# EAGLE design ip_extra (EAGLE 6.4)
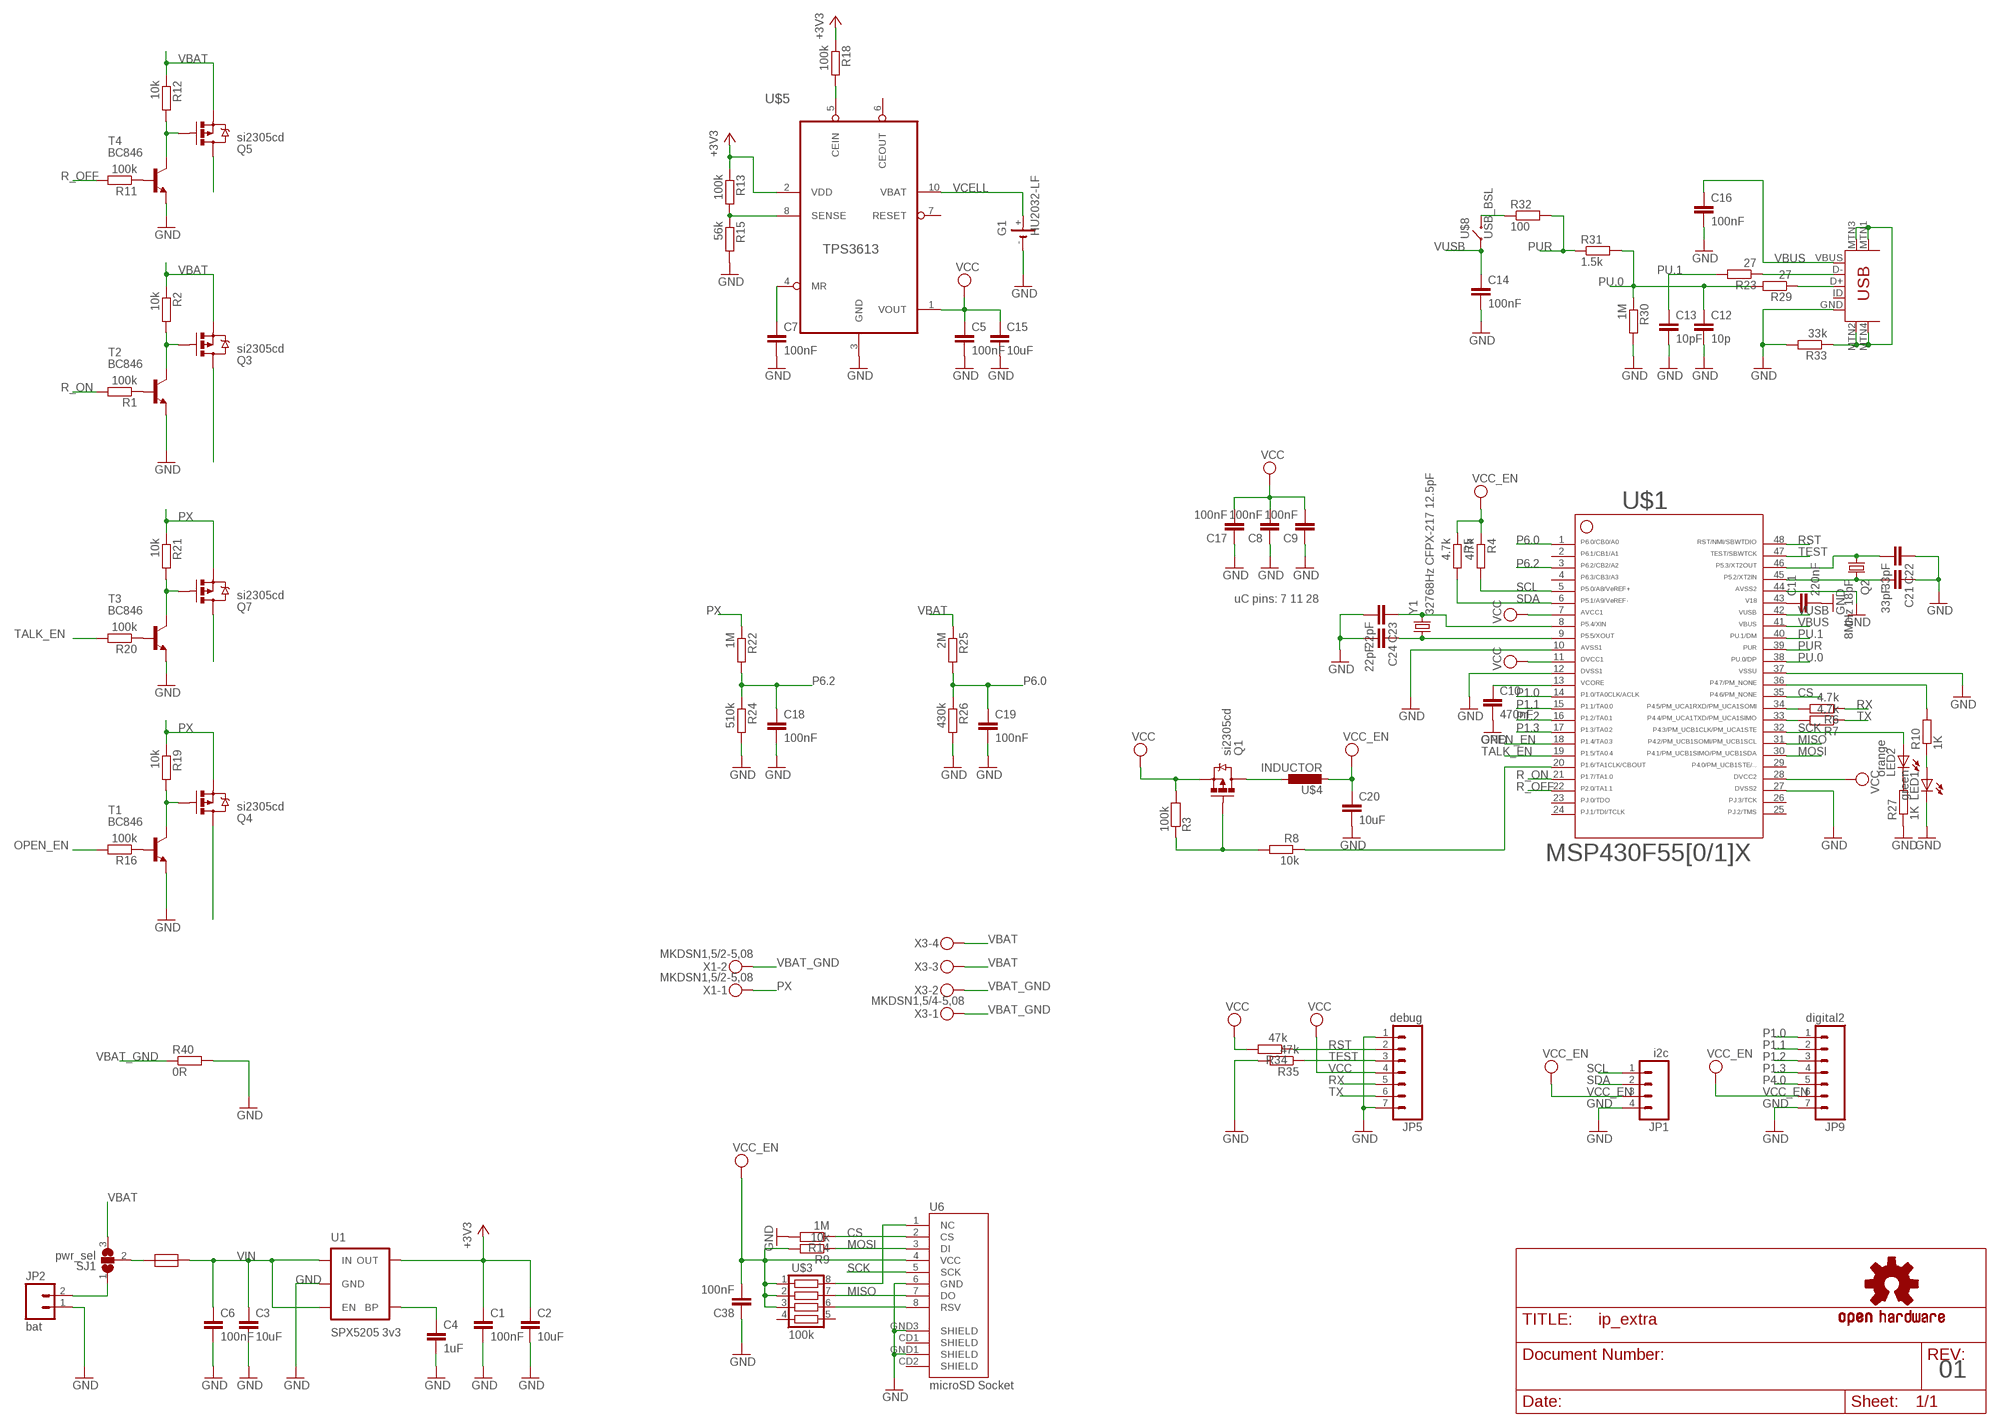
[diagram p0: schematic, sheet 1]

## Parts
C1  100nF  C-EUC0805  [C0805]
C2  10uF  C-EUC1206  [C1206]
C3  10uF  C-EUC1206  [C1206]
C4  1uF  C-EUC0805  [C0805]
C5  100nF  C-EUC0805  [C0805]
C6  100nF  C-EUC0805  [C0805]
C7  100nF  C-EUC0805  [C0805]
C8  100nF  C-EUC0805  [C0805]
C9  100nF  C-EUC0805  [C0805]
C10  470nF  C-EUC0805  [C0805]
C11  220nF  C-EUC0805  [C0805]
C12  10p  C-EUC0805  [C0805]
C13  10pF  C-EUC0805  [C0805]
C14  100nF  C-EUC0805  [C0805]
C15  10uF  C-EUC1206  [C1206]
C16  100nF  C-EUC0805  [C0805]
C17  100nF  C-EUC0805  [C0805]
C18  100nF  C-EUC0805  [C0805]
C19  100nF  C-EUC0805  [C0805]
C20  10uF  C-EUC1206  [C1206]
C21  33pF  C-EUC0805  [C0805]
C22  33pF  C-EUC0805  [C0805]
C23  22pF  C-EUC0805  [C0805]
C24  22pF  C-EUC0805  [C0805]
C38  100nF  C-EUC0805  [C0805]
G1  HU2032-LF  [HU2032-LF]
JP1  i2c  M04PTH  [1X04]
JP2  bat  M02PTH  [1X02]
JP5  debug  M07  [1X07]
JP9  digital2  M07  [1X07]
LED1  green  LEDCHIP-LED0805  [CHIP-LED0805]
LED2  orange  LEDCHIP-LED0805  [CHIP-LED0805]
Q1  si2305cd  MOSFET-PCHANNELSMD_POWER  [SOT23-3_POWER]
Q2  8MHz 18pF  CRYTAL  [CRYSTAL_5X3.2]
Q3  si2305cd  MOSFET-PCHANNELSMD_POWER  [SOT23-3_POWER]
Q4  si2305cd  MOSFET-PCHANNELSMD_POWER  [SOT23-3_POWER]
Q5  si2305cd  MOSFET-PCHANNELSMD_POWER  [SOT23-3_POWER]
Q7  si2305cd  MOSFET-PCHANNELSMD_POWER  [SOT23-3_POWER]
R1  100k  R-EU_R0805W  [R0805W]
R2  10k  R-EU_R0805W  [R0805W]
R3  100k  R-EU_R0805W  [R0805W]
R4  4.7k  R-EU_R0805W  [R0805W]
R5  4.7k  R-EU_R0805W  [R0805W]
R6  4.7k  R-EU_R0805W  [R0805W]
R7  4.7k  R-EU_R0805W  [R0805W]
R8  10k  R-EU_R0805W  [R0805W]
R9  10k  R-EU_R0805W  [R0805W]
R10  1K  R-EU_R0805W  [R0805W]
R11  100k  R-EU_R0805W  [R0805W]
R12  10k  R-EU_R0805W  [R0805W]
R13  100k  R-EU_R0805W  [R0805W]
R14  1M  R-EU_R0805W  [R0805W]
R15  56k  R-EU_R0805W  [R0805W]
R16  100k  R-EU_R0805W  [R0805W]
R18  100k  R-EU_R0805W  [R0805W]
R19  10k  R-EU_R0805W  [R0805W]
R20  100k  R-EU_R0805W  [R0805W]
R21  10k  R-EU_R0805W  [R0805W]
R22  1M  R-EU_R0805W  [R0805W]
R23  27  R-EU_R0805W  [R0805W]
R24  510k  R-EU_R0805W  [R0805W]
R25  2M  R-EU_R0805W  [R0805W]
R26  430k  R-EU_R0805W  [R0805W]
R27  1K  R-EU_R0805W  [R0805W]
R29  27  R-EU_R0805W  [R0805W]
R30  1M  R-EU_R0805W  [R0805W]
R31  1.5k  R-EU_R0805W  [R0805W]
R32  100  R-EU_R0805W  [R0805W]
R33  33k  R-EU_R0805W  [R0805W]
R34  47k  R-EU_R0805W  [R0805W]
R35  47k  R-EU_R0805W  [R0805W]
R40  0R  R-EU_R0805W  [R0805W]
SJ1  pwr_sel  SJ2W  [SJ_2]
T1  BC846  [SOT23]
T2  BC846  [SOT23]
T3  BC846  [SOT23]
T4  BC846  [SOT23]
U1  SPX5205 3v3  V_REG_LDOSMD  [SOT23-5]
U6  microSD Socket  USD-SOCKETNEW  [MICRO-SD-SOCKET-PP]
U$1  F55[0/1]X---PT48  [PT48]
U$2  RESETTABLE  [1210]
U$3  100k  RES_ARR  [YC164]
U$4  INDUCTOR  [L0805W]
U$5  TPS3613  [MSOP_10P]
U$6  USB-MINIB-5PIN  [USB-MINIB]
U$7  OSHW-LOGOM  [OSHW-LOGO-M]
U$8  USB_BSL  TACT_SW  [6X3.5_TACTILE_SW]
X1  MKDSN1,5/2-5,08  [MKDSN1,5/2-5,08]
X3  MKDSN1,5/4-5,08  [MKDSN1,5/4-5,08]
Y1  32768Hz CFPX-217 12.5pF  CRYSTAL3.2X1.5  [CRYSTAL-SMD-3.2X1.5]

## Nets
+3V3: C1.1 C2.1 R13.1 R18.1 U1.5(OUT) U$5.2(VDD)
CS: R14.1 U6.2(CS) U$1.35
EN: R8.1 U$1.20
GND: C1.2 C2.2 C3.2 C4.2 C5.2 C6.2 C7.2 C8.1 C9.1 C10.2 C11.2 C12.2 C13.2 C14.2 C15.2 C16.2 C17.1 C18.2 C19.2 C20.2 C21.1 C22.1 C23.2 C24.2 C38.1 G1.- JP1.4 JP2.1 JP5.1 JP5.7 JP9.7 LED1.C R14.2 R15.2 R24.2 R26.2 R27.1 R30.2 R33.2 R35.2 R40.2 T1.2(E) T2.2(E) T3.2(E) T4.2(E) U1.2(GND) U6.6(GND) U6.GND1(SHIELD) U6.GND3(SHIELD) U$1.10 U$1.12 U$1.27 U$1.37 U$1.44 U$5.3(GND) U$6.GND
LED: R10.2 U$1.36
MISO: U6.7(DO) U$1.31 U$3.7
MOSI: R9.1 U6.3(DI) U$1.30
N$1: LED1.A R10.1
N$2: C4.1 U1.4(BP)
N$3: R16.1 T1.1(B)
N$4: U6.1(NC) U$3.8
N$6: C10.1 U$1.13
N$7: C11.1 U$1.43
N$8: R1.1 T2.1(B)
N$9: JP2.2 SJ1.1
N$10: Q3.1(G) R2.2 T2.3(C)
N$11: R6.2 U$1.34
N$12: Q3.3(D)
N$13: R7.2 U$1.33
N$14: Q1.1(G) R3.1 R8.2
N$15: R11.1 T4.1(B)
N$16: Q5.1(G) R12.2 T4.3(C)
N$17: C22.2 Q2.P$1 U$1.46
N$18: Q5.3(D)
N$19: R13.2 R15.1 U$5.8(SENSE)
N$20: C7.1 U$5.4(MR)
N$21: R18.2 U$5.5(CEIN)
N$22: R29.1 U$6.D+
N$23: C21.2 Q2.P$2 U$1.45
N$25: C24.1 U$1.9 Y1.P$1
N$26: C23.1 U$1.8 Y1.P$2
N$27: U6.8(RSV) U$3.6
N$28: Q4.1(G) R19.2 T1.3(C)
N$29: R23.1 U$6.D-
N$30: Q4.3(D)
N$31: R20.1 T3.1(B)
N$32: Q7.1(G) R21.2 T3.3(C)
N$34: R32.1 U$8.2
N$35: Q7.3(D)
N$36: R33.1 U$6.MTN1(MTN2) U$6.MTN2(MTN3) U$6.MTN3(MTN1) U$6.MTN4
N$37: Q1.3(D) U$4.1
N$39: LED2.C R27.2
N$40: SJ1.2 U$2.P$1
OPEN_EN: R16.2 U$1.18
P1.0: JP9.1 U$1.14
P1.1: JP9.2 U$1.15
P1.2: JP9.3 U$1.16
P1.3: JP9.4 U$1.17
P4.0: JP9.5
P6.0: C19.1 R25.2 R26.1 U$1.1
P6.2: C18.1 R22.2 R24.1 U$1.3
PU.0: C12.1 R29.2 R30.1 R31.2 U$1.38
PU.1: C13.1 R23.2 U$1.40
PUR: R31.1 R32.2 U$1.39
PX: Q4.2(S) Q7.2(S) R19.1 R21.1 R22.1 X1.1
R_OFF: R11.2 U$1.22
R_ON: R1.2 U$1.21
RST: JP5.2 R34.1 U$1.48
RX: JP5.5 R6.1
SCK: LED2.A U6.5(SCK) U$1.32
SCL: JP1.1 R4.2 U$1.5
SDA: JP1.2 R5.2 U$1.6
TALK_EN: R20.2 U$1.19
TEST: JP5.3 R35.1 U$1.47
TX: JP5.6 R7.1
VBAT: Q3.2(S) Q5.2(S) R2.1 R12.1 R25.1 SJ1.3 X3.3 X3.4
VBAT_GND: R40.1 X1.2 X3.1 X3.2
VBUS: C16.1 U$1.41 U$6.VBUS
VCC: C5.1 C8.2 C9.2 C15.1 C17.2 JP5.4 Q1.2(S) R3.2 R34.2 U$1.7 U$1.11 U$1.28 U$5.1(VOUT)
VCC_EN: C20.1 C38.2 JP1.3 JP9.6 R4.1 R5.1 R9.2 U6.4(VCC) U$3.1 U$3.2 U$3.3 U$4.2
VCELL: G1.+ U$5.10(VBAT)
VIN: C3.1 C6.1 U1.1(IN) U1.3(EN) U$2.P$2
VUSB: C14.1 U$1.42 U$8.1
Unconnected: G1.+@1(+) U6.CD1(SHIELD) U6.CD2(SHIELD) U$1.2 U$1.4 U$1.23 U$1.24 U$1.25 U$1.26 U$1.29 U$3.4 U$3.5 U$5.6(CEOUT) U$5.7(RESET) U$6.ID

## Notes on the sheet
- uC pins: 7 11 28
- 01

## Library data of the parts
C1-C24 C38 = rcl:C-EU: CAPACITOR, European symbol
G1 = Simplex-Battery:HU2032-LF: Renata HU2032 Li battery holder
JP1 = SparkFun-Connectors:M04: Header 4 Standard 4-pin 0.1" header. Use with straight break away headers (SKU : PRT-00116), right angle break away headers (PRT-00553), swiss pins (PRT-00743), machine pins (PRT-00117), and female headers (PRT-00115). Molex polarized connector foot print use with SKU : PRT-08231 with associated crimp pins and housings. 1MM SMD Version SKU: PRT-10208
JP2 = SparkFun:M02: Header 2 Standard 2-pin 0.1" header. Use with straight break away headers (SKU : PRT-00116), right angle break away headers (PRT-00553), swiss pins (PRT-00743), machine pins (PRT-00117), and female headers (PRT-00115). Molex polarized connector foot print use with SKU : PRT-08233 with associated crimp pins and housings.
JP5 JP9 = SparkFun-Connectors:M07: Header 7 Standard 7-pin 0.1" header. Use with straight break away headers (SKU : PRT-00116), right angle break away headers (PRT-00553), swiss pins (PRT-00743), machine pins (PRT-00117), and female headers (PRT-00115). NOTES ON THE VARIANTS LOCK and LOCK_LONGPADS... This footprint was designed to help hold the alignment of a through-hole component (i.e. 7-pin header) while soldering it into place. You may notice that each hole has been shifted either up or down by 0.005 of an inch from it's more standard position (which is usually a perfectly straight line). This slight alteration caused the pins (the squares in the middle) to touch the edges of the holes. Because they are alternating, it causes a "brace" to hold the header in place. 0.005 has proven to be the perfect amount of "off-center" position when using our standard breakaway headers. Although looks a little odd when you look at the bare footprint, once you have a header in there, the alteration is very hard to notice. Also, if you push a header all the way into place, it is covered up entirely on the bottom side. This idea of altering the position of holes to aid alignment will be further integrated into the Sparkfun Library for other footprints. It can help hold any component with 3 or more connection pins.
LED1 LED2 = led:LED: LED OSRAM: - CHIPLED LG R971, LG N971, LY N971, LG Q971, LY Q971, LO R971, LY R971 LH N974, LH R974 LS Q976, LO Q976, LY Q976 LO Q996 - Hyper CHIPLED LW Q18S LB Q993, LB Q99A, LB R99A - SideLED LS A670, LO A670, LY A670, LG A670, LP A670 LB A673, LV A673, LT A673, LW A673 LH A674 LY A675 LS A676, LA A676, LO A676, LY A676, LW A676 LS A679, LY A679, LG A679 - Hyper Micro SIDELED® LS Y876, LA Y876, LO Y876, LY Y876 LT Y87S - SmartLED LW L88C, LW L88S LB L89C, LB L89S, LG L890 LS L89K, LO L89K, LY L89K LS L896, LA L896, LO L896, LY L896 - TOPLED LS T670, LO T670, LY T670, LG T670, LP T670 LSG T670, LSP T670, LSY T670, LOP T670, LYG T670 LG T671, LOG T671, LSG T671 LB T673, LV T673, LT T673, LW T673 LH T674 LS T676, LA T676, LO T676, LY T676, LB T676, LH T676, LSB T676, LW T676 LB T67C, LV T67C, LT T67C, LS T67K, LO T67K, LY T67K, LW E67C LS E67B, LA E67B, LO E67B, LY E67B, LB E67C, LV E67C, LT E67C LW T67C LS T679, LY T679, LG T679 LS T770, LO T770, LY T770, LG T770, LP T770 LB T773, LV T773, LT T773, LW T773 LH T774 LS E675, LA E675, LY E675, LS T675 LS T776, LA T776, LO T776, LY T776, LB T776 LHGB T686 LT T68C, LB T68C - Hyper Mini TOPLED® LB M676 - Mini TOPLED Santana® LG M470 LS M47K, LO M47K, LY M47K Source: http://www.osram.convergy.de LUXEON: - LUMILED® LXK2-PW12-R00, LXK2-PW12-S00, LXK2-PW14-U00, LXK2-PW14-V00 LXK2-PM12-R00, LXK2-PM12-S00, LXK2-PM14-U00 LXK2-PE12-Q00, LXK2-PE12-R00, LXK2-PE12-S00, LXK2-PE14-T00, LXK2-PE14-U00 LXK2-PB12-K00, LXK2-PB12-L00, LXK2-PB12-M00, LXK2-PB14-N00, LXK2-PB14-P00, LXK2-PB14-Q00 LXK2-PR12-L00, LXK2-PR12-M00, LXK2-PR14-Q00, LXK2-PR14-R00 LXK2-PD12-Q00, LXK2-PD12-R00, LXK2-PD12-S00 LXK2-PH12-R00, LXK2-PH12-S00 LXK2-PL12-P00, LXK2-PL12-Q00, LXK2-PL12-R00 Source: www.luxeon.com KINGBRIGHT: KA-3528ASYC Source: www.kingbright.com
Q1 Q3-Q5 Q7 = Simplex-DiscreteSemi:MOSFET-PCHANNEL: Generic PMOSFET
Q2 = Omat_komponentit:CRYTAL: CRYSTAL
R1-R16 R18-R27 R29-R35 R40 = rcl:R-EU_: RESISTOR, European symbol
SJ1 = jumper:SJ2W: SMD solder JUMPER
T1-T4 = transistor:BC846: NPN TRANSISTOR
U1 = SparkFun:V_REG_LDO: Voltage Regulator LDO Standard 150mA LDO voltage regulator in SOT-23 layout. Micrel part MIC5205. BP (by-pass) pin is used to lower output noise with 470pF cap.
U6 = SparkFun:USD-SOCKET: microSD Socket Push-push type uSD socket. Schematic element and footprint production proven. Spark Fun Electronics SKU : PRT-00127. tDoc lines correctly indicate media card edge positions when inserting (unlocked, locked, depressed).
U$1 = TI_MSP430_v16:F55[0/1]X---PT48: ***F55[0/1/2]X*** PT48 Rev. 1.0 06/2010 "http://www.ti.com/lit/gpn/msp430f5509" Only for FF5504, F5508,F5509,F5510
U$2 = Simplex-Fuses:RESETTABLE
U$3 = Simplex-rlc:RES_ARR: resistor chip array yageo YC164 series (8pin/4R)
U$4 = Simplex-rlc:INDUCTOR: smd inductors
U$5 = Simplex-ICs:TPS3613: Texas Instruments TPS3613 Adjustable battery-backup supervisor for RAM retension
U$6 = SparkFun-Connectors:USB-MINIB: Mini-USB "B" connector with 5th pin broken out. Created new symbol breaking out 5th "ID" pin in mini/micro USB connector spec. See: http://en.wikipedia.org/wiki/Mini_usb#Cables. Uses same footprint as 4-pin symbol. Also added pins to connect to mounting / shield pads if required (probably not generally needed as signals aren't shielded once they leave the connector).
U$7 = SparkFun:OSHW-LOGO: Open Source Hardware Logo This logo indicates the piece of hardware it is found on incorporates a OSHW license and/or adheres to the definition of open source hardware found here: http://freedomdefined.org/OSHW
U$8 = Simplex-Switches:TACT_SW: SPST tactile switches
X1 = con-phoenix-508:MKDSN1,5/2-5,08: MKDSN 1,5/ 2-5,08 Printklemme Nennstrom: 13,5 A Nennspannung: 250 V Rastermaß: 5,08 mm Polzahl: 2 Anschlussart: Schraubanschluss Montage: Löten Anschlussrichtung Leiter/Platine: 0 ° Artikelnummer: 1729128 Source: http://eshop.phoenixcontact.com .. 1729128.pdf; MPN: MKDSN 1,5/2-5.08; OC_FARNELL: 1792903; OC_NEWARK: 30M2397
X3 = con-phoenix-508:MKDSN1,5/4-5,08: MKDSN 1,5/ 4-5,08 Printklemme Nennstrom: 13,5 A Nennspannung: 250 V Rastermaß: 5,08 mm Polzahl: 4 Anschlussart: Schraubanschluss Montage: Löten Anschlussrichtung Leiter/Platine: 0 ° Artikelnummer: 1729144 Source: http://eshop.phoenixcontact.com .. 1729144.pdf; MPN: SMKDSN1,5/4-5,08; OC_FARNELL: 1792905; OC_NEWARK: 70R0300
Y1 = Simplex-FreqCtrl:CRYSTAL: smd crystals

## Net classes
1 vcc: width 0.203 mm

## Board
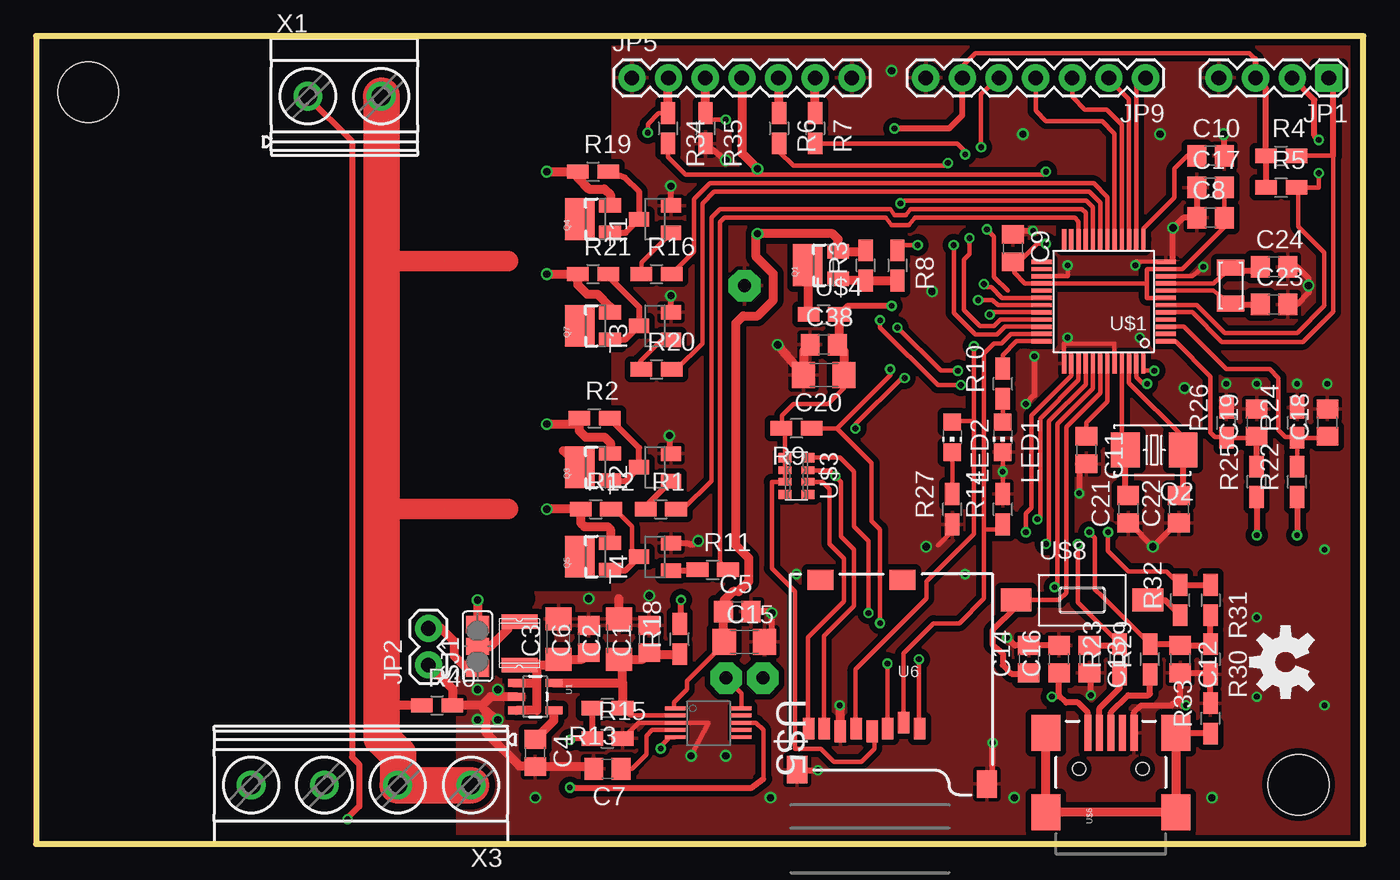
[diagram p1: board, top side]
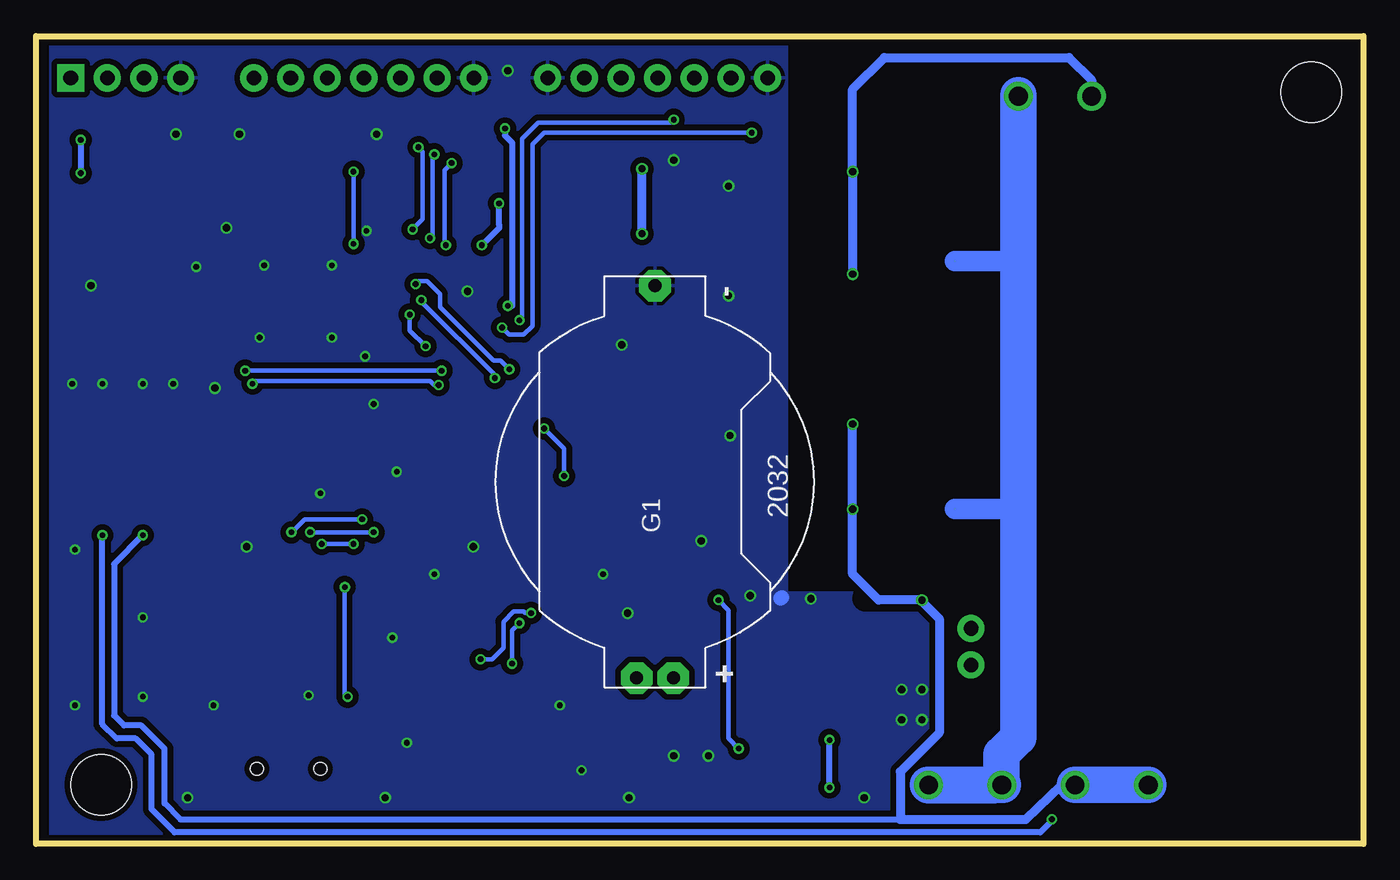
[diagram p2: board, bottom side, seen from below]

Size 92 x 56 mm. Coordinates in mm from the lower left corner, seen from the top.
Outline: 0,0 92,0 92,56 0,56 0,0
Copper layers (1*16): Top 0.035mm / dielectric 1.5mm / Bottom 0.035mm
Design rules "seeedstudio_rules_v1.1": minimum track width 6mil, minimum drill 12mil, track to track 6mil, track to pad 6mil, pad to pad 6mil, via to via 6mil, smd to smd 0mil, copper to edge 10mil, drill to drill 10mil, minimum pad ring 10mil, minimum via ring 6mil, stop-mask expansion 2mil, vias tented up to drill 100mil, thermal gap 10mil
Holes 4.2 mm at 3.6,52.1 87.5,4.1
tRestrict: 2 lines
bRestrict: 1 lines

### Footprints (pad centres in the part's own frame; a part is rotated, then mirrored left to right if it is on the bottom)
C0805 = smd 1.3 x 1.5: 1 -0.95,0; 2 0.95,0
C1206 = smd 1.6 x 1.8: 1 -1.4,0; 2 1.4,0
HU2032-LF = drill 0.9 pad 2.184 octagon: + -13.6,-1.27; +@1 -13.6,1.27; - 13.6,0
1X04 = drill 1.016 pad 1.88 square: 1 0,0 | drill 1.016 pad 1.88: 2 2.54,0; 3 5.08,0; 4 7.62,0
1X02 = drill 1.016 pad 1.88: 1 0,0; 2 2.54,0
1X07 = drill 1.016 pad 1.88: 1 0,0; 2 2.54,0; 3 5.08,0; 4 7.62,0; 5 10.16,0; 6 12.7,0; 7 15.24,0
CHIP-LED0805 = smd 1.2 x 1.2: A 0,-1.05; C 0,1.05
SOT23-3_POWER = smd 1 x 1.5: 1 -0.939,-1.384; 2 0.961,-1.384 | smd 2.9 x 2.05: 3 0.011,0.716
CRYSTAL_5X3.2 = smd 2 x 2.4: P$1 -2,0; P$2 2,0
R0805W = smd 1.5 x 1: 1 -1.052,0; 2 1.052,0
SJ_2 = smd 1.168 x 1.6: 1 -1.524,0; 2 0,0; 3 1.524,0
SOT23 = smd 1 x 1.4: 1 -0.95,-1.1; 2 0.95,-1.1; 3 0,1.1
SOT23-5 = smd 0.55 x 1.2: 1 -0.95,-1.3; 2 0,-1.3; 3 0.95,-1.3; 4 0.95,1.3; 5 -0.95,1.3
MICRO-SD-SOCKET-PP = smd 0.8 x 1.5: 1 -8.94,10.7; 2 -7.84,10.3; 3 -6.74,10.7; 4 -5.64,10.9; 5 -4.54,10.7; 6 -3.44,10.9; 7 -2.34,10.7; 8 -1.24,10.7 | smd 1.8 x 1.4: CD1 -2.05,0.4; CD2 -7.75,0.4 | smd 1.4 x 1.9: GND1 -13.6,14.55; GND3 -0.45,13.55
PT48 = smd 1.4 x 0.3: 1 -4.3,2.75; 2 -4.3,2.25; 3 -4.3,1.75; 4 -4.3,1.25; 5 -4.3,0.75; 6 -4.3,0.25; 7 -4.3,-0.25; 8 -4.3,-0.75; 9 -4.3,-1.25; 10 -4.3,-1.75; 11 -4.3,-2.25; 12 -4.3,-2.75; 25 4.3,-2.75; 26 4.3,-2.25; 27 4.3,-1.75; 28 4.3,-1.25; 29 4.3,-0.75; 30 4.3,-0.25; 31 4.3,0.25; 32 4.3,0.75; 33 4.3,1.25; 34 4.3,1.75; 35 4.3,2.25; 36 4.3,2.75 | smd 0.3 x 1.4: 13 -2.75,-4.3; 14 -2.25,-4.3; 15 -1.75,-4.3; 16 -1.25,-4.3; 17 -0.75,-4.3; 18 -0.25,-4.3; 19 0.25,-4.3; 20 0.75,-4.3; 21 1.25,-4.3; 22 1.75,-4.3; 23 2.25,-4.3; 24 2.75,-4.3; 37 2.75,4.3; 38 2.25,4.3; 39 1.75,4.3; 40 1.25,4.3; 41 0.75,4.3; 42 0.25,4.3; 43 -0.25,4.3; 44 -0.75,4.3; 45 -1.25,4.3; 46 -1.75,4.3; 47 -2.25,4.3; 48 -2.75,4.3
1210 = smd 1 x 2.5: P$1 -1.5,0; P$2 1.5,0
YC164 = smd 0.65 x 0.9: 1 -1.275,-0.8; 4 1.275,-0.8; 5 1.275,0.8; 8 -1.275,0.8 | smd 0.5 x 0.9: 2 -0.4,-0.8; 3 0.4,-0.8; 6 0.4,0.8; 7 -0.4,0.8
L0805W = smd 1.5 x 1: 1 -1.052,0; 2 1.052,0
MSOP_10P = smd 0.27 x 1.4: 1 0,0; 2 0.5,0; 3 1,0; 4 1.5,0; 5 2,0; 6 2,4.6; 7 1.5,4.6; 8 1,4.6; 9 0.5,4.6; 10 0,4.6
USB-MINIB = smd 2.5 x 0.5: D+ 2.5,0; D- 2.5,0.8; GND 2.5,-1.6; ID 2.5,-0.8; VBUS 2.5,1.6 | smd 2.5 x 2: MTN1 -3,4.5; MTN2 2.5,4.5; MTN3 -3,-4.5; MTN4 2.5,-4.5 | hole 0.9: 0,2.2; 0,-2.2
6X3.5_TACTILE_SW = smd 2.12 x 1.6: 1 -4.56,0; 2 4.56,0
MKDSN1,5/2-5,08 = drill 1.3 pad 2: 1 -2.561,0.025; 2 2.519,0.025
MKDSN1,5/4-5,08 = drill 1.3 pad 2: 1 -7.641,0.025; 2 -2.561,0.025; 3 2.519,0.025; 4 7.599,0.025
CRYSTAL-SMD-3.2X1.5 = smd 1.1 x 1.9: P$1 -1.25,0; P$2 1.25,0

### Placement (x,y rotation side)
C1  42.5,14.2 90 top
C2  40.4,14.2 90 top
C3  36.2,14.2 90 top
C4  34.6,6.3 270 top
C5  48.6,16.1 0 top
C6  38.3,14.2 90 top
C7  39.6,5.2 180 top
C8  81.4,43.4 0 top
C9  67.7,41.3 270 top
C10  81.4,47.7 0 top
C11  72.8,27.3 270 top
C12  79.3,12.8 270 top
C13  73,12.8 270 top
C14  68.8,12.8 90 top
C15  49.1,14 0 top
C16  70.9,12.8 90 top
C17  81.4,45.5 0 top
C18  89.5,29.2 90 top
C19  84.6,29.2 90 top
C20  54.6,32.5 180 top
C21  75.7,23.2 90 top
C22  79.2,23.2 90 top
C23  85.8,37.4 0 top
C24  85.8,40 0 top
C38  54.6,34.6 0 top
G1  49.1,25.1 90 bottom
JP1  89.6,53.1 180 top
JP2  27.2,12.4 90 top
JP5  41.3,53.1 0 top
JP9  76.9,53.1 180 top
LED1  67,28.2 180 top
LED2  63.5,28.2 180 top
Q1  54.2,40.1 90 top
Q2  77.5,27.3 180 top
Q3  38.4,26.1 90 top
Q4  38.4,43.3 90 top
Q5  38.4,19.9 90 top
Q7  38.4,35.9 90 top
R1  43.3,23.2 0 top
R2  38.7,29.5 0 top
R3  57.5,40.1 90 top
R4  86.3,47.7 0 top
R5  86.3,45.5 0 top
R6  51.5,49.6 270 top
R7  54,49.6 270 top
R8  59.7,40.1 270 top
R9  52.7,28.8 180 top
R10  67,31.9 90 top
R11  46.9,19 0 top
R12  38.8,23.2 0 top
R13  39.6,9.4 180 top
R14  67,23.2 90 top
R15  39.6,7.3 0 top
R16  43,39.5 0 top
R18  44.6,14.2 90 top
R19  38.6,46.6 0 top
R20  43,32.9 0 top
R21  38.6,39.5 0 top
R22  87.4,25.1 90 top
R23  75.1,12.8 90 top
R24  87.4,29.2 90 top
R25  84.6,25.1 90 top
R26  82.5,29.2 90 top
R27  63.5,23.2 90 top
R29  77.2,12.8 90 top
R30  81.4,12.8 270 top
R31  81.4,16.9 270 top
R32  79.3,16.9 90 top
R33  81.4,8.7 90 top
R34  43.8,49.6 270 top
R35  46.4,49.6 270 top
R40  27.8,9.6 0 top
SJ1  30.6,13.7 90 top
T1  42.9,43.3 90 top
T2  42.9,26.1 90 top
T3  42.9,35.9 90 top
T4  42.9,19.9 90 top
U1  34.6,10.2 270 top
U6  52.3,18.7 180 top
U$1  74,37.6 180 top
U$2  33.5,13.9 270 top
U$3  52.7,25.5 270 top
U$4  54.6,36.7 0 top
U$5  44.3,9.4 270 top
U$6  74.5,5.2 90 top
U$7  86.6,12.6 90 top
U$8  72.5,16.9 0 top
X1  21.4,51.8 0 top
X3  22.5,4.1 180 top
Y1  82.8,38.7 270 top

### Tracks (layer width: path | path; a pad name or v marks a point on that pad's centre or on a via)
+3V3
  Top 0.305: U$5.2 41.15,8.9 R13.1
  Top 0.406: 40.45,9.6 R13.1
  Top 0.61: 40.45,9.6 arc90 R13.1 40.65,11.15 | U1.5 40.65,11.15 | 40.65,11.15 40.65,12.55 C2.1 42.05,12.8 C1.1 42.5,13.15 R18.1
CS
  Top 0.305: U6.2 60.1,8.44 60.1,13.2 62.2,15.3 64,15.3 65.7,17 65.7,21.8 | U$1.35 67.55,35.35 66.9,34.7 66.4,34.7 65.7,34 65.7,21.8 | R14.1 66.65,21.8 65.7,21.8
EN  (via drill 0.4)
  Top 0.305: U$1.20 73.25,44.15 72.8,44.6 59.9,44.6 v59.9,44.4 | R8.1 60.05,41.5 v61.1,41.5
  Bottom 0.406: v59.9,44.4 59.9,42.9 59.9,42.7 v61.1,41.5
GND  (via drill 0.4, 0.5)
  Top 0.305: v45.4,6.1 46.6,8.4 U$5.3 41.75,8.4 R15.2 | U$1.10 80.15,39.35 v80.9,40 | U$1.44 74.75,34.7 71.5,34.7 | U$1.37 71.25,34.7 71.5,34.7 | U$1.27 71.5,39.35 v71.5,40.1 | 71.5,34.7 v71.5,35.1 | U$1.12 76.2,40.35 v76.2,40.1 | R14.2 v67,25.8 LED1.C | 62.5,20.7 63.5,21.7 R27.1
  Top 0.406: 79.05,9.95 78.7,9.6 76.6,9.6 76.1,9.1 U$6.GND | 79.05,9.95 79.3,10.2 C12.2 81.3,11.85 R30.2 R33.2 | v73.1,10.3 73.1,11.75 C13.2 | C16.2 C14.2 67.85,13.75 v67.3,14.3 | v79.7,9.6 79.4,9.6 79.05,9.95 | C15.2 51,14.5 v51,16 50.9,16.1 C5.2 | T1.2 v44,45.6 | T3.2 v44,38 | v43.9,28.3 43.9,27.15 arc90 T2.2 | T4.2 45.15,20.85 arc90 v45.9,21 | C11.2 72.3,25.85 v72.3,24.3 | 75.8,22.2 v77.4,20.6 79.05,22.25 C22.1 | 75.8,22.2 75.6,22.2 | 75.8,22.2 75.75,22.25 C21.1 | 55.6,7.74 U6.6 | C24.2 87.4,40 88.2,39.2 v88.2,38.7 88.2,38.2 87.4,37.4 C23.2 | C17.1 C8.1 79.5,43.4 v78.8,42.7 78.8,40.4 | v82.3,49.2 C10.2 | R35.2 v47.8,47.4 | v69.2,33.8 69.2,31.1 v68.6,30.5 | C9.1 67.95,42.5 v69.1,42.5 | U6.GND1 66.3,4.55 v66.3,7 | U6.GND3 52.8,5.1 v54.2,5.1
  Top 0.61: JP2.1 28.85,10.75 R40.2 30.8,9.6 | U1.2 31.5,10.2 30.9,9.6 30.8,9.6 | v32,8.6 31.4,9 31.2,9.2 | 31.2,9.2 30.8,9.6 | C7.2 38.5,5.35 C4.2 34.55,5.4 33.5,5.4 31.2,7.7 31.2,9.2 | C20.2 v51.4,34.6 | C20.2 53.2,32.75 | C38.1 53.2,34.15 C20.2 | v55.7,9.6 55.7,7.84 U6.6 | C2.2 40.4,17
  Bottom 1.016: 40.3,17.1 40.4,17
  other vias: 42.5,17.2 47.8,6.1 32,10.7 76.5,35.1 38.3,17 62.1,38.3 68.4,49.2 59.3,53.6 79.6,31.6 50.9,3.2 77.9,49.2 61.7,20.6 34.6,3.2 30.6,10.7 30.6,8.6 64.4,18.7 52.7,18.7 84.6,10.2 84.6,15.7 89.3,20.4 89.3,9.6 89.5,31.9 67.8,3.2 81.5,3.2 82.5,31.9 84.6,31.9 87.4,31.9
  pour Top (isolate 0.254): 45.2,9.8 48,9.8 48,6.6 49.6,6.6 49.6,4.6 41.9,4.6 41.9,6.5 45.2,6.5
  pour Top (isolate 0.254): 30,11 32.4,11 32.4,8.3 30,8.3
  pour Bottom (isolate 0.406): 40,55.4 91,55.4 91,0.6 40,0.6
  pour Bottom (isolate 0.406): 29.2,17.4 42.4,17.4 42.4,0.5 29.2,0.5
  pour Top (isolate 0.406): 40,55.4 91,55.4 91,0.6 40,0.6
  pour Top (isolate 0.406): 29.2,17.4 42.4,17.4 42.4,0.5 29.2,0.5
LED
  Top 0.305: U$1.36 67.95,34.85 67,33.9 R10.2
MISO  (via drill 0.4)
  Top 0.305: U6.7 54.6,8.04 54.6,14.4 56.7,16.5 56.7,20.4 55.8,21.3 55.8,25.1 v55.4,25.5 55,25.9 U$3.7 | U$1.31 66.65,37.35 66.3,37.7 v65.3,37.7 | v56.8,28.8 56.8,29.1 60,32.3 v60.2,32.3
  Bottom 0.305: v55.4,25.5 55.4,27.4 v56.8,28.8 | v60.2,32.3 60.2,32.5 65.3,37.6 v65.3,37.7
MOSI  (via drill 0.4)
  Top 0.305: U6.3 59,8.04 v59,12.5 | U$1.30 66.95,37.85 66.2,38.6 65.9,38.6 v65.7,38.8 | R9.1 55.5,28.8 | 55.5,28.8 57.9,26.4 57.9,22.4 58.5,21.8 v58.5,15.3 | 55.5,28.8 59.2,32.5 v59.2,32.9
  Bottom 0.305: v58.5,15.3 59,14.8 v59,12.5 | v59.2,32.9 59.8,33.5 60.3,33.5 64,37.2 64,38.1 64.9,39 65.5,39 v65.7,38.8
N$1
  Top 0.305: LED1.A R10.1
N$2
  Top 0.61: C4.1 35.9,8.55 35.9,8.6 | 35.9,8.6 | 35.9,8.6 U1.4
N$3
  Top 0.305: R16.1 41.95,40.3 T1.1
N$4  (via drill 0.4)
  Top 0.305: U6.1 61.2,8.04 v61.2,12.8 | U$3.8 55.73,26.77 56.7,25.8 56.7,22 57.7,21 v57.7,16
  Bottom 0.305: v61.2,12.8 60.4,12.8 59.6,13.6 59.6,15.4 58.9,16.1 58.2,16.1 58.1,16 v57.7,16
N$6
  Top 0.305: C10.1 79.8,47.7 78.9,46.8 78.9,44.8 76.75,42.65 U$1.13
N$7
  Top 0.305: U$1.43 74.25,30.65 72.8,29.2 C11.1
N$8
  Top 0.406: T2.1 42.25,23.4 R1.1
N$9
  Top 0.61: SJ1.1 29.82,12.18 29,13 29,14 28.06,14.94 JP2.2
N$10
  Top 0.406: Q3.1 40.86,25.16 T2.3 41.8,27.45 R2.2
N$11  (via drill 0.4)
  Top 0.305: U$1.34 67.15,35.85 66.6,35.3 65.1,35.3 63.6,36.8 v63.6,41.5 | v63.2,47.2 63.2,47 52.5,47 51.5,48 R6.2
  Bottom 0.305: v63.2,47.2 63.7,46.7 63.7,41.6 v63.6,41.5
N$12
  Top 0.61: 36.54,27.25 Q3.3
N$13  (via drill 0.4)
  Top 0.305: U$1.33 66.85,36.35 66.4,35.9 65.4,35.9 64.3,37 64.3,40.5 64.7,40.9 v64.7,42 | v64.4,47.8 64.4,48 63.85,48.55 R7.2
  Bottom 0.305: v64.4,47.8 64.5,47.7 64.5,42.2 v64.7,42
N$14
  Top 0.61: R8.2 R3.1 55.7,39.05 Q1.1
N$15
  Top 0.406: T4.1 45.8,18.95 R11.1
N$16
  Top 0.305: R12.2 40.1,23.2 41.3,22 41.3,20.4 T4.3
  Top 0.406: 41.7,20 T4.3 40.86,18.96 Q5.1
N$17
  Top 0.305: U$1.46 75.75,31.95 79.5,28.2 79.5,27.8 Q2.P$1
  Top 0.406: Q2.P$1 78.75,26.55 | C22.2 79.5,24.15 79.5,27.8
N$18
  Top 0.61: 37.02,19.25 Q5.3
N$19  (via drill 0.4)
  Top 0.305: 50.4,4.5 50.4,7.9 49.9,8.4 U$5.8
  Top 0.406: R13.2 R15.1 37.1,7.3 v37,7.2 | v37,3.9 49.6,3.9 50.4,4.5
  Bottom 0.406: v37,3.9 v37,7.2
N$20
  Top 0.305: C7.1 41.3,5.2 42.3,6.2 42.3,7.5 42.7,7.9 U$5.4
N$21  (via drill 0.4)
  Top 0.305: U$5.5 43.9,7.4 43.3,6.8 v43.3,6.6
  Top 0.406: R18.2 44.7,15.35 v44.7,16.9
  Bottom 0.305: v43.3,6.6 44,7.3 44,16.2 v44.7,16.9
N$22
  Top 0.406: U$6.D+ 74.5,9.1 75.7,10.3 77.1,10.3 77.2,10.4 R29.1
N$23
  Top 0.305: U$1.45 75.25,27.85 Q2.P$2 75.1,27.2 75.35,27.2
  Top 0.406: 75.35,27.2 76.25,26.3 | C21.2 75.5,24.15 Q2.P$2
N$25
  Top 0.305: U$1.9 81.6,38.85 Y1.P$1 82.7,39.75
  Top 0.406: 82.7,39.75 84.5,39.75 C24.1
N$26
  Top 0.305: U$1.8 81.6,38.35 Y1.P$2 82.7,37.65
  Top 0.406: 82.7,37.65 82.95,37.4 C23.1
N$27
  Top 0.305: U6.8 53.5,8.04 53.5,14.3 56,16.8 56,19.8 55,20.8 55,24.6 54.5,25.1 U$3.6
N$28
  Top 0.406: Q4.1 40.86,42.36 T1.3 41.8,45.2 40.8,46.2 R19.2
N$29
  Top 0.406: U$6.D- 73.7,9.4 75.1,10.8 R23.1
N$31
  Top 0.305: R20.1 41.85,33.45 43.3,34.9 43.95,34.9 T3.1
N$32
  Top 0.406: Q7.1 40.86,34.96 T3.3 41.8,37.2 39.65,39.35 R21.2
N$34
  Top 0.406: U$8.2 78.25,16.9 R32.1
N$35
  Top 0.61: 37.35,36.35 Q7.3
N$36
  Top 0.406: U$6.MTN4 81.35,7.7 R33.1
  Top 0.61: U$6.MTN2 U$6.MTN1 U$6.MTN3 U$6.MTN4
N$37
  Top 0.61: Q1.3 53.48,36.76 U$4.1
N$39
  Top 0.305: LED2.C R27.2
N$40
  Top 0.61: SJ1.2 31.5,13.7 32.7,14.9 32.7,15.5 U$2.P$1
OPEN_EN
  Top 0.305: R16.2 45.6,41.05 45.6,44.7 46.7,45.8 73.3,45.8 74.25,44.85 U$1.18
P1.0
  Top 0.305: U$1.14 76.25,52.55 76.8,53.1 JP9.1
P1.1
  Top 0.305: U$1.15 75.75,51.61 74.36,53 JP9.2
P1.2
  Top 0.305: U$1.16 75.25,49.85 74.2,50.9 72.7,50.9 71.82,51.78 JP9.3
P1.3
  Top 0.305: U$1.17 74.75,49.25 73.9,50.1 70,50.1 69.28,50.82 JP9.4
P4.0  (via drill 0.4)
  Top 0.305: 65.5,48.2 v65.5,48.3 65.5,51.96 JP9.5 | v65.9,42.6 66.4,42.1 66.4,39.3 67.35,38.35
  Bottom 0.305: v65.5,48.3 65.2,48 65.2,43.3 v65.9,42.6
P6.0
  Top 0.305: U$1.1 78.95,34.85 81.4,32.4 81.4,28.5 81.7,28.2 82.45,28.2 R26.1 84.5,28.15 C19.1
  Top 0.406: R25.2 C19.1
P6.2
  Top 0.305: U$1.3 79.55,35.85 82.5,32.9 85.5,32.9 86.1,32.3 86.1,28.7 86.6,28.2 87.35,28.2 R24.1 | R24.1 89.4,28.15 C18.1 | R24.1 R22.2
PU.0  (via drill 0.4)
  Top 0.305: U$1.38 71.75,32.45 69,29.7 69,23.3 68.6,22.9 v68.6,21.6 | R29.2 74.18,16.88 73.9,17.15 73.4,17.65 73.4,21.2 v73,21.6
  Top 0.406: R29.2 79.2,13.85 C12.1 81.3,13.75 R30.1 R31.2
  Bottom 0.305: v73,21.6 v68.6,21.6
PU.1  (via drill 0.4)
  Top 0.305: R23.2 72.88,16.08 72.7,16.25 72.2,16.75 v72.2,20.8 72,20.9 | U$1.40 72.75,31.85 70.2,29.3 70.2,20.9 v70,20.8
  Top 0.406: C13.1 75,13.75 R23.2
  Bottom 0.305: v72.2,20.8 v70,20.8
PUR  (via drill 0.4)
  Top 0.305: U$1.39 72.25,32.15 69.6,29.5 69.6,22.5 v69.4,22.5 | R32.2 78.35,18.9 75.7,18.9 74.3,20.3 v74.3,21.6
  Top 0.406: R32.2 R31.1
  Bottom 0.305: v74.3,21.6 73.4,22.5 v69.4,22.5
PX  (via drill 0.4, 0.5)
  Top 0.406: 39.9,36.88 Q7.2 | R22.1 v87.4,21.4 | v21.6,1.7 21.6,1.8 22.4,2.6 22.4,5.5 21.9,6 21.9,48.7 18.8,51.8
  Top 0.61: R21.1 37.6,39.45 | Q7.2 39.78,37.22 38.9,38.1 38.2,38.1 37.55,38.75 R21.1 | Q4.2 39.8,44.28 39.8,45 39.4,45.4 38.3,45.4 37.55,46.15 R19.1 v35.4,46.6 | R21.1 37.6,39.5 | v35.4,39.5 R21.1 | 18.8,51.8 18.82,51.83 X1.1
  Bottom 0.406: v87.4,21.4 87.4,8.3 86.4,7.3 85.1,7.3 84,6.2 84,2.4 82.4,0.8 22.4,0.8 21.6,1.6 v21.6,1.7
  Bottom 0.61: 18.8,51.86 X1.1 18.84,52.94 20.4,54.5 33.2,54.5 35.4,52.3 v35.4,46.6 v35.4,39.5
R_OFF
  Top 0.305: U$1.22 72.25,43.15 72,43.4 60.9,43.4 60.5,42.9 59.3,42.9 58.9,43.4 47.7,43.4 47.4,43.1 47.4,19.55 R11.2
R_ON
  Top 0.305: R1.2 44.95,23.45 | U$1.21 72.75,43.75 72.5,44 60.6,44 60.3,43.6 59.5,43.6 59.2,44 47.4,44 46.8,43.4 46.8,25.15 44.85,23.2
  Top 0.406: 44.85,23.2 R1.2
RST  (via drill 0.4)
  Top 0.305: R34.1 43.15,50.65 42.4,49.9 v42.4,49.3 | v77.5,32.8 76.75,32.8 U$1.48 | v59.7,35.8 62.7,32.8 v63.9,32.8
  Top 0.61: R34.1 43.8,53.06 JP5.2
  Bottom 0.305: v42.4,49.3 56.8,49.3 57.6,48.5 57.6,35.9 58.2,35.3 59.2,35.3 v59.7,35.8 | v63.9,32.8 v77.5,32.8
RX
  Top 0.61: R6.1 51.5,53.06 JP5.5
SCK  (via drill 0.4)
  Top 0.305: U6.5 56.8,8.04 56.8,12.1 61.7,17 61.7,18.2 65,21.5 65,29.3 | 65,29.3 65,34.3 65.1,34.4 v65,34.5 | U$1.32 66.25,36.85 v66.1,36.7 | LED2.A 63.55,29.3 65,29.3
  Bottom 0.305: v66.1,36.7 66.1,35.6 v65,34.5
SCL
  Top 0.305: U$1.5 80.15,36.85 82.2,34.8 87.8,34.8 89.9,36.9 89.9,47.7 R4.2 | 89.9,52.8 JP1.1
  Top 0.406: 89.9,47.7 89.9,52.8
SDA  (via drill 0.4)
  Top 0.305: U$1.6 80.45,37.35 82.4,35.4 87.4,35.4 89.3,37.3 89.3,41 87.5,42.8 87.5,45.35 | R5.2 88.9,45.5 v88.9,46.5
  Top 0.406: 87.5,45.35 R5.2 | v88.9,48.8 88.6,49.1 88.6,51.56 JP1.2
  Bottom 0.406: v88.9,48.8 v88.9,46.5
TALK_EN
  Top 0.305: R20.2 44.4,32.9 46.2,34.7 46.2,44.4 47,45.2 73,45.2 73.75,44.45 U$1.19
TEST  (via drill 0.4)
  Top 0.305: R35.1 46.85,50.2 v47.8,50.2 | U$1.47 76.25,32.35 76.7,31.9 v77,31.9 | v58.5,36.3 58.5,35.8 62.5,31.8 v64.1,31.8
  Top 0.61: JP5.3 46.38,50.73 R35.1
  Bottom 0.305: v47.8,50.2 48,50 57.2,50 58.3,48.9 58.3,36.4 v58.5,36.3 | v77,31.9 76.8,32.1 64.7,32.1 64.4,31.8 v64.1,31.8
TX
  Top 0.61: R7.1 JP5.6
VBAT  (via drill 0.4, 0.5)
  Top 0.406: 39.7,27.14 Q3.2 | R25.1 v84.6,21.4
  Top 0.61: v35.4,29.1 37.45,29.1 R2.1 37.65,28.65 38.1,28.2 39.4,28.2 39.8,27.8 39.8,27.08 Q3.2 | v35.4,23.2 R12.1 37.75,22.25 38,22 39.6,22 39.8,21.8 39.8,20.88 Q5.2 | v30.6,16.9 SJ1.3
  Bottom 0.406: v84.6,21.4 86.6,19.4 86.6,8.9 85.9,8.2 84.7,8.2 83.1,6.6 83.1,2.8 82,1.7 32.1,1.7 | X3.4 14.93,4.1 15.9,4.1
  Bottom 0.61: v35.4,29.1 v35.4,23.2 35.4,18.7 33.6,16.9 v30.6,16.9 30.6,16.8 29.4,15.6 29.4,7.7 32.1,5 32.1,1.7 23.4,1.7 20.93,4.08 X3.3 19.98,4.08 20,4.1
  Bottom 2.54: 14.9,4.1 15.9,4.1 20,4.1
VBAT_GND  (2 unrouted)
  Top 0.61: R40.1 23.96,9.6
  Top 1.422: 32.7,40.4 28.3,40.4 24.1,40.4 23.96,40.54 | 32.7,23.2 28.3,23.2 23.96,23.2
  Top 2.54: X3.1 X3.2 25.1,4.11 25.1,6.2 23.96,7.34 23.96,9.6 23.96,23.2 23.96,40.54 23.96,51.87 X1.2
  Bottom 0.406: 23.9,51.8 X1.2
  Bottom 1.422: 28.3,40.4 23.5,40.4 | 28.3,23.2 23.7,23.2
  Bottom 2.54: 25.57,4.1 30.2,4.1 | 25,4.1 25.1,4.1 | 25.1,4.1 25.57,4.1 | 25.57,4.1 25.6,4.08 X3.1 | 23.9,51.9 23.9,51.8 23.9,19 23.9,7.4 25.1,6.2 25.1,4.1
VBUS  (via drill 0.4)
  Top 0.305: U$1.41 73.25,31.55 70.8,29.1 70.8,18 v70.6,17.8 | 70.9,10.3 70.8,10.2 v70.4,10.2
  Top 0.406: U$6.VBUS 72.9,9.1 72.2,9.8 71.4,9.8 70.9,10.3 C16.1
  Bottom 0.305: v70.4,10.2 70.6,10.4 v70.6,17.8
VCC  (via drill 0.4, 0.5)
  Top 0.305: U$5.1 44.2,9.5 44.2,9.8 45.1,10.7 45.1,11.3 47.7,13.9 C15.1 | U$1.7 77,37.85 77,38.85 | 77,38.85 77,39.8 77.05,39.85 U$1.11 79.45,39.85 82.35,42.75 C8.2 C17.2 | 77,38.85 U$1.28 68.55,38.85 67.8,39.6 C9.2 | 50.4,46.4 69.8,46.4 v70,46.6 | 50.4,46.4 arc-90 v50,46.8 | R34.2 43.8,47.6 45,46.4 50.4,46.4 | 68.15,40.35 69.4,41.6 v70,41.6
  Top 0.406: C15.1 47.65,14.05 | v50,46.8 50.2,46.6 | C9.2 68.15,40.35
  Top 0.61: R3.2 57.41,41.06 Q1.2 55.58,41.92 55.2,42.3 v50,42.3 49.9,42.2 49.9,40.7 51.1,39.5 51.1,37.7 50,36.6 49,36.6 48.5,36.1 48.5,20.7 49.4,19.8 49.4,18.2 48.7,17.5 48.3,17.5 47.7,16.9 47.7,16.15 C5.1 47.65,14.05 | JP5.4 48.92,47.88 v50,46.8
  Bottom 0.305: v70,41.6 v70,46.6
  Bottom 0.61: v50,42.3 v50,46.8
VCC_EN  (via drill 0.4)
  Top 0.305: C20.1 56,31.6 54.9,30.5 52.5,30.5 51.7,29.7 51.7,28.85 R9.2 51.9,28.55 U$3.1 U$3.2 U$3.3 51,25.1 51,19.1 52.6,17.5 52.6,6.6 54.4,6.6 55.3,5.7 57.2,5.7 58.1,6.6 58.1,7.64 U6.4 57.9,7.84 | 84.5,54.4 84.1,54.8 65.1,54.8 64.2,53.9 JP9.6
  Top 0.406: R5.1 R4.1 85.25,52.37 JP1.3 84.5,53.12 84.5,54.4 | U$4.2 56.25,37.3 v59.3,37.3 | v59.5,49.6 63.3,49.6 64.2,50.5 JP9.6
  Top 0.61: U$4.2 55.65,34.7 C38.2 56,34.15 C20.1
  Bottom 0.406: v59.5,49.6 59.5,49.1 59,48.6 59,37.3 v59.3,37.3
VCELL
  Top 0.305: U$5.10 48.9,10.43 G1.+
VIN
  Top 0.61: 33.13,11.15 U1.1 34.7,11.15 | 34.7,11.15 34.7,9.25 U1.3 | 36.2,12.5 C3.1 | C3.1 37.85,12.8 C6.1 | 34.7,11.15 34.7,12.5 U$2.P$2 36.2,12.4 C3.1
VUSB
  Top 0.305: U$1.42 73.75,31.25 71.4,28.9 71.4,17.4 70.9,16.9 U$8.1
  Top 0.406: C14.1 68.75,11.8 67.6,11.8 67,12.4 67,13.2 66.3,13.8 66.3,14.8 67.94,16.44 U$8.1

### Text on the board
tmine: pv+ | pv- | gnd | rst | test | vcc | rx | tx | gnd | photov | debug | en | digital | i2c | gnd | vcc | 4.0 | 1.3 | 1.2 | 1.1 | 1.0 | gnd | vcc | en | sda | scl | opt sw | 12V bat | + | + | - | - | sc rev 01 Petre Rodan 201305